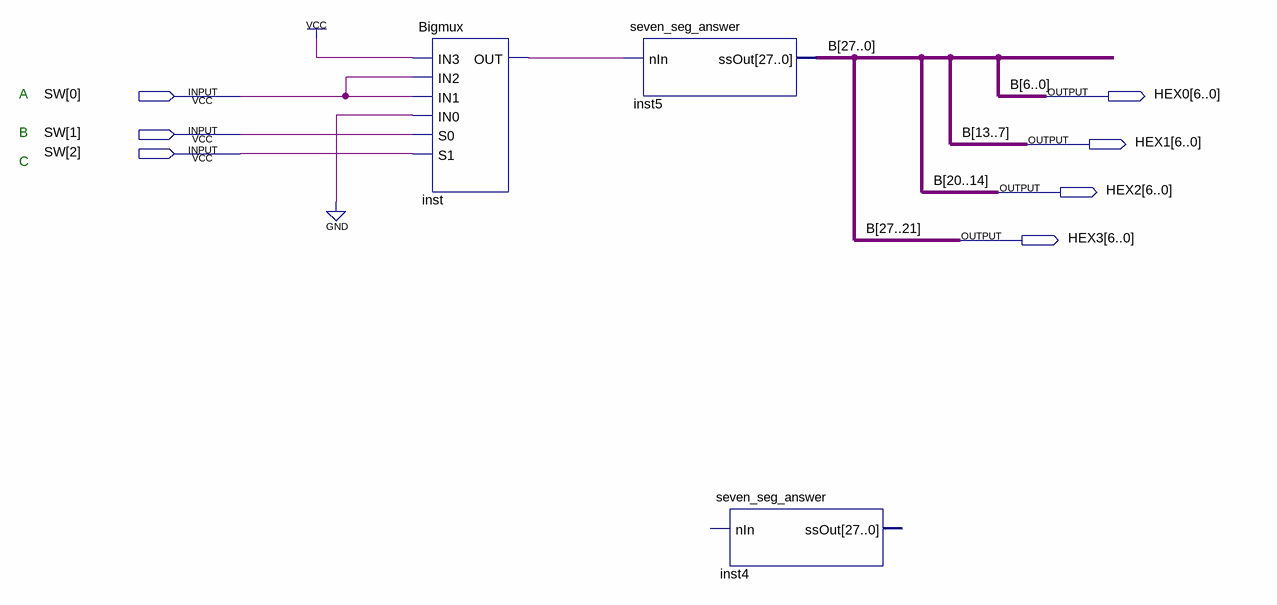
[diagram p0: schematic sheet]
// Quartus schematic partb.bdf as structural Verilog: 3 symbols, 7 pins
module partb (
  input  [2:0] SW,
  output [6:0] HEX0,
  output [6:0] HEX1,
  output [6:0] HEX2,
  output [6:0] HEX3
);

  wire inst_out;

  Bigmux inst (.IN3(1'b1), .IN2(SW[0]), .IN1(SW[0]), .IN0(1'b0), .S0(SW[1]), .S1(SW[2]), .OUT(inst_out));
  seven_seg_answer inst5 (.nIn(inst_out), .ssOut({HEX3, HEX2, HEX1, HEX0}));
  seven_seg_answer inst4 ();  // open: nIn, ssOut

  // Other names for the same wires on the sheet: B[27:0] = {HEX3, HEX2, HEX1, HEX0}

  // Notes on the sheet:
  //   A
  //   B
  //   C
endmodule
